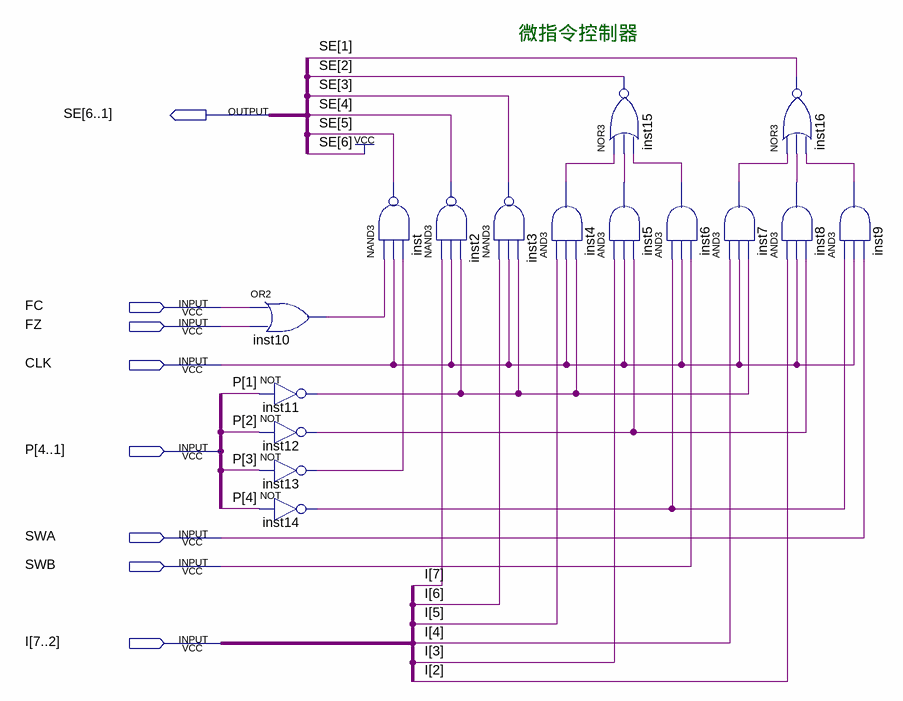
[diagram p0: schematic sheet]
// Quartus schematic uI_C.bdf as structural Verilog: 16 symbols, 8 pins
module uI_C (
  input  FC,
  input  FZ,
  input  CLK,
  input  [4:1] P,
  input  SWA,
  input  SWB,
  input  [7:2] I,
  output [6:1] SE
);

  wire inst4_out, inst5_out, inst6_out, inst7_out, inst8_out, inst9_out, inst10_out, inst11_out, inst12_out,
       inst13_out, inst14_out;

  or inst10 (inst10_out, FC, FZ);
  not inst11 (inst11_out, P[1]);
  not inst12 (inst12_out, P[2]);
  not inst13 (inst13_out, P[3]);
  not inst14 (inst14_out, P[4]);
  nand inst (SE[5], inst10_out, CLK, inst13_out);
  nand inst2 (SE[4], I[7], CLK, inst11_out);
  nand inst3 (SE[3], I[6], CLK, inst11_out);
  and inst4 (inst4_out, I[5], CLK, inst11_out);
  nor inst15 (SE[2], inst4_out, inst5_out, inst6_out);
  and inst5 (inst5_out, I[3], CLK, inst12_out);
  and inst6 (inst6_out, inst14_out, CLK, SWB);
  nor inst16 (SE[1], inst7_out, inst8_out, inst9_out);
  and inst7 (inst7_out, I[4], CLK, inst11_out);
  and inst8 (inst8_out, I[2], CLK, inst12_out);
  and inst9 (inst9_out, inst14_out, CLK, SWA);

  assign SE[6] = 1'b1;

  // Notes on the sheet:
  //   微指令控制器
endmodule
